# EAGLE design ocf4riser (EAGLE 7.7.0)
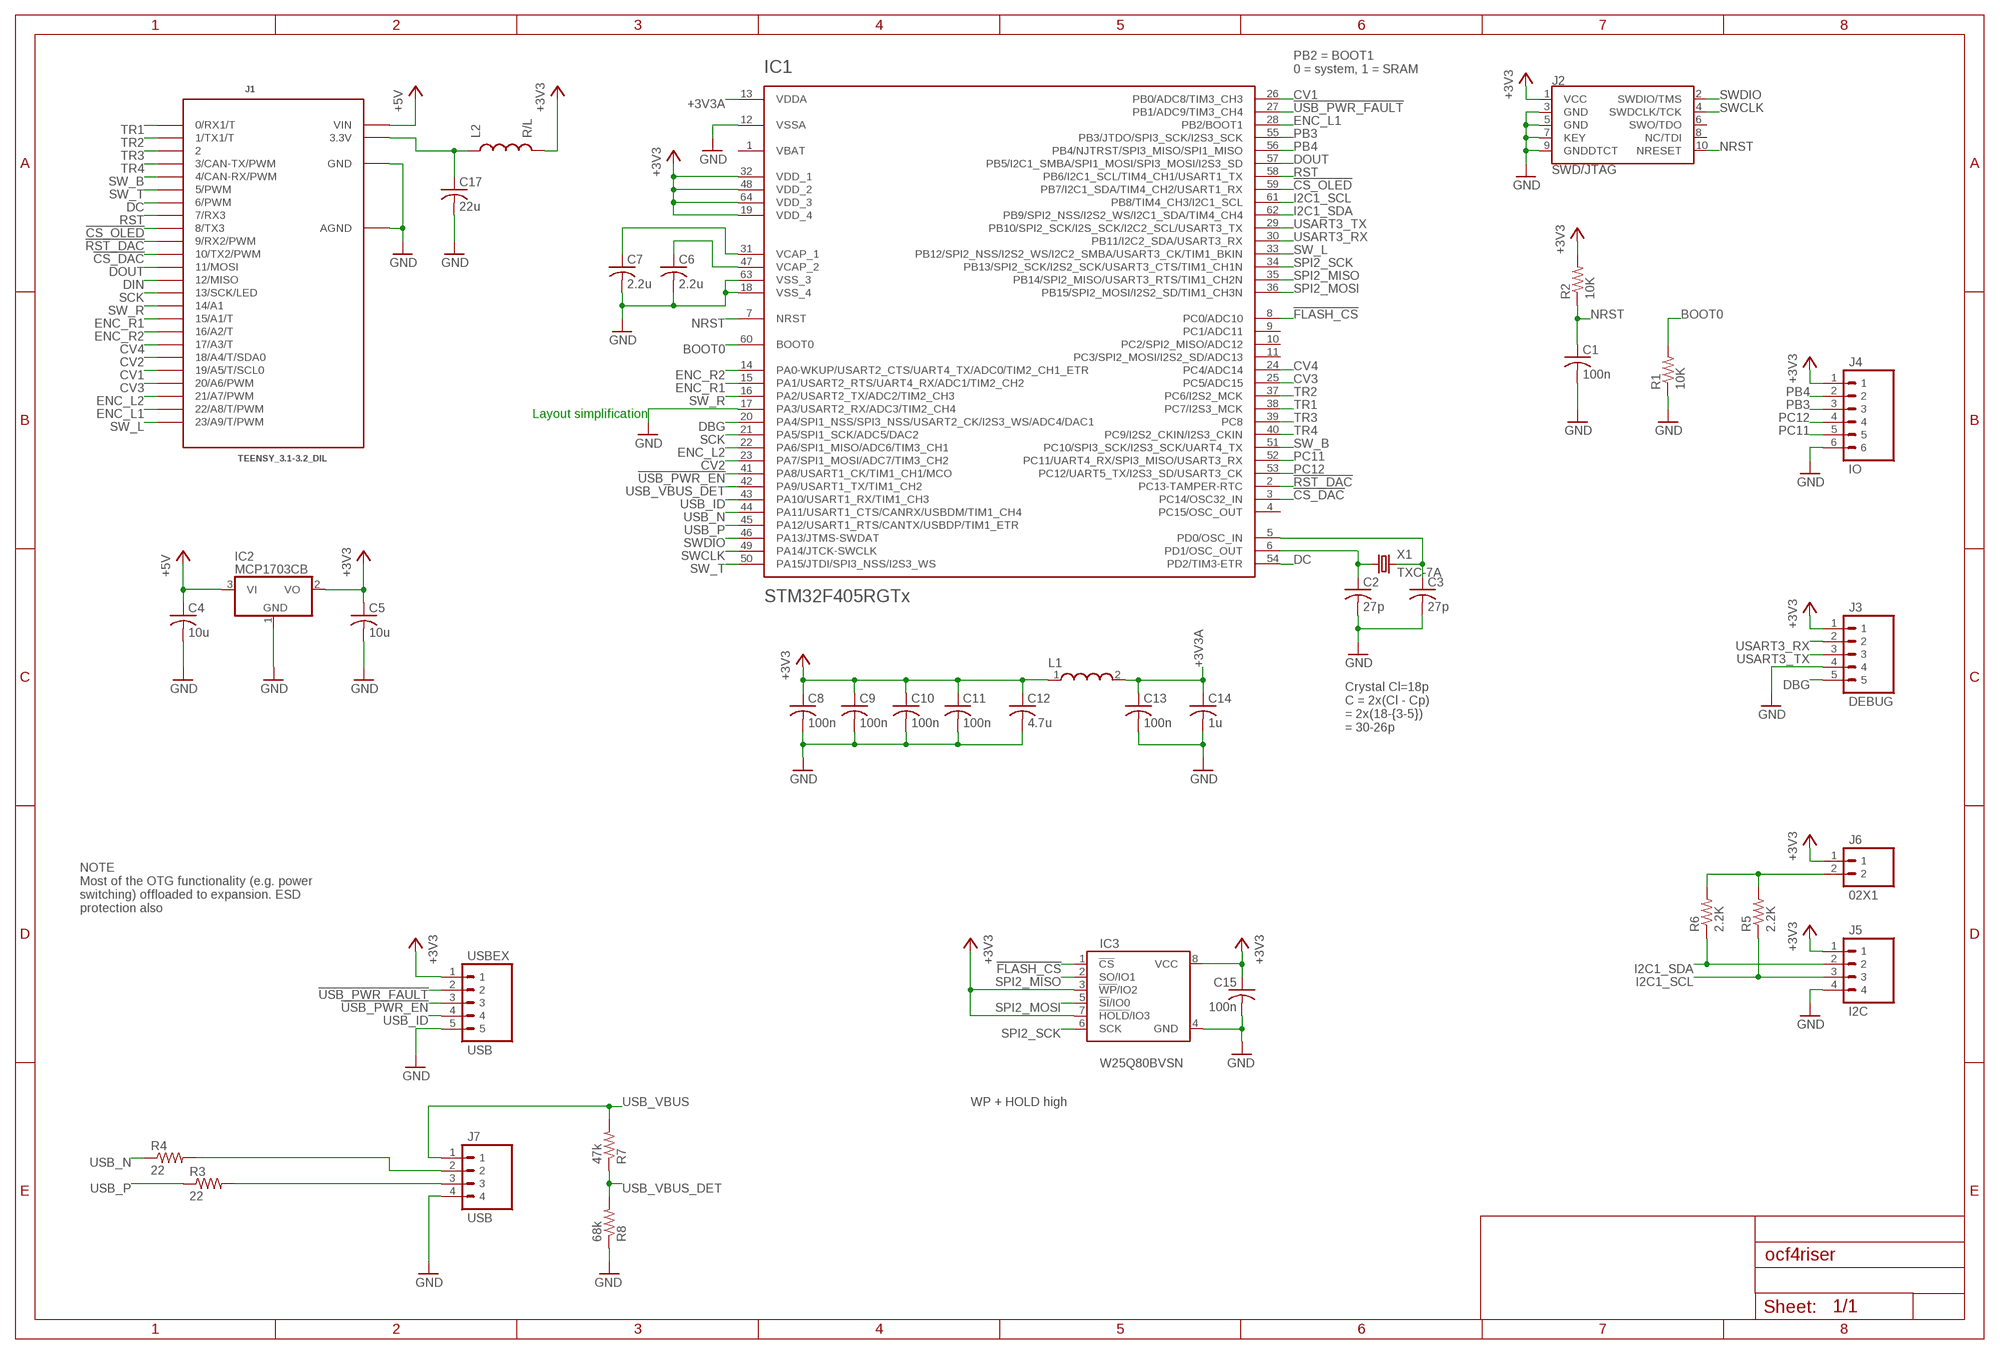
[diagram p0: schematic, sheet 1]

## Parts
C1  100n  C-USC0402  [C0402]
C2  27p  C-USC0402  [C0402]
C3  27p  C-USC0402  [C0402]
C4  10u  C-USC0805  [C0805]
C5  10u  C-USC0805  [C0805]
C6  2.2u  C-USC0603  [C0603]
C7  2.2u  C-USC0603  [C0603]
C8  100n  C-USC0402  [C0402]
C9  100n  C-USC0402  [C0402]
C10  100n  C-USC0402  [C0402]
C11  100n  C-USC0402  [C0402]
C12  4.7u  C-USC0603  [C0603]
C13  100n  C-USC0402  [C0402]
C14  1u  C-USC0603  [C0603]
C15  100n  C-USC0402  [C0402]
C17  22u  C-USC0805  [C0805]
IC1  STM32F405RGTx  STM32F20X  [TQFP-10X10-64]
IC2  MCP1703CB  [SOT23]
IC3  W25Q80BVSN  SPIFLASHN  [SOIC-8]
J1  TEENSY_3.1-3.2_DIL  [TEENSY_3.0-3.2&LC_DIL]
J2  SWD/JTAG  CORTEX_DEBUGNAKED  [2X5-1.27]
J3  DEBUG  05X1  [05X1-THIN]
J4  IO  06X1  [06X1-THIN]
J5  I2C  04X1  [04X1-THIN]
J6  02X1  [02X1-THIN]
J7  USB  04X1  [04X1-THIN]
L1  WE-CBF_0603(WB/HS)  [WE-CBF_0603(W=2.2)]
L2  R/L  INDUCTOR0805  [0805]
R1  10K  R-US_R0402  [R0402]
R2  10K  R-US_R0402  [R0402]
R3  22  R-US_R0402  [R0402]
R4  22  R-US_R0402  [R0402]
R5  2.2K  R-US_R0603  [R0603]
R6  2.2K  R-US_R0603  [R0603]
R7  47k  R-US_R0402  [R0402]
R8  68k  R-US_R0402  [R0402]
USBEX  USB  05X1  [05X1-THIN]
X1  TXC-7A  [CRYSTAL-TXC-7A]

## Nets
!CS_DAC: IC1.3(PC14/OSC32_IN) J1.10(10/TX2/PWM)
!CS_OLED: IC1.59(PB7/I2C1_SDA/TIM4_CH2/USART1_RX) J1.8(8/TX3)
!FLASH_CS: IC1.8(PC0/ADC10) IC3.1(!CS!)
!RST_DAC: IC1.2(PC13-TAMPER-RTC) J1.9(9/RX2/PWM)
!USB_PWR_EN: IC1.41(PA8/USART1_CK/TIM1_CH1/MCO) USBEX.3
!USB_PWR_FAULT: IC1.27(PB1/ADC9/TIM3_CH4) USBEX.2
+3V3: C5.1 C8.1 C9.1 C10.1 C11.1 C12.1 C15.1 IC1.19(VDD_4) IC1.32(VDD_1) IC1.48(VDD_2) IC1.64(VDD_3) IC2.2(VO) IC3.3(!WP!/IO2) IC3.7(!HOLD!/IO3) IC3.8(VCC) J2.1(VCC) J3.1 J4.1 J5.1 J6.1 L1.1 L2.2 R2.2 USBEX.1
+3V3A: C13.1 C14.1 IC1.13(VDDA) L1.2
+5V: C4.1 IC2.3(VI) J1.VIN
BOOT0: IC1.60(BOOT0) R1.2
CV1: IC1.26(PB0/ADC8/TIM3_CH3) J1.19/A5(19/A5/T/SCL0)
CV2: IC1.23(PA7/SPI1_MOSI/ADC7/TIM3_CH2) J1.18/A4(18/A4/T/SDA0)
CV3: IC1.25(PC5/ADC15) J1.20/A6(20/A6/PWM)
CV4: IC1.24(PC4/ADC14) J1.17/A3(17/A3/T)
DBG: IC1.20(PA4/SPI1_NSS/SPI3_NSS/USART2_CK/I2S3_WS/ADC4/DAC1) J3.5
DC: IC1.54(PD2/TIM3-ETR) J1.6(6/PWM)
DIN: J1.12(12/MISO)
DOUT: IC1.57(PB5/I2C1_SMBA/SPI1_MOSI/SPI3_MOSI/I2S3_SD) J1.11(11/MOSI)
ENC_L1: IC1.28(PB2/BOOT1) J1.22/A8(22/A8/T/PWM)
ENC_L2: IC1.22(PA6/SPI1_MISO/ADC6/TIM3_CH1) J1.21/A7(21/A7/PWM)
ENC_R1: IC1.15(PA1/USART2_RTS/UART4_RX/ADC1/TIM2_CH2) J1.15/A1(15/A1/T)
ENC_R2: IC1.14(PA0-WKUP/USART2_CTS/UART4_TX/ADC0/TIM2_CH1_ETR) J1.16/A2(16/A2/T)
GND: C1.2 C2.2 C3.2 C4.2 C5.2 C6.2 C7.2 C8.2 C9.2 C10.2 C11.2 C12.2 C13.2 C14.2 C15.2 C17.2 IC1.12(VSSA) IC1.17(PA3/USART2_RX/ADC3/TIM2_CH4) IC1.18(VSS_4) IC1.63(VSS_3) IC2.1(GND) IC3.4(GND) J1.AGND J1.GND J2.3(GND) J2.5(GND) J2.7(KEY) J2.9(GNDDTCT) J3.4 J4.6 J5.4 J7.4 R1.1 R8.1 USBEX.5
I2C1_SCL: IC1.61(PB8/TIM4_CH3/I2C1_SCL) J5.3 R5.1
I2C1_SDA: IC1.62(PB9/SPI2_NSS/I2S2_WS/I2C1_SDA/TIM4_CH4) J5.2 R6.1
I2C_PU: J6.2 R5.2 R6.2
N$1: C17.1 J1.3.3V L2.1
N$2: C3.1 IC1.5(PD0/OSC_IN) X1.P$2
N$3: C2.1 IC1.6(PD1/OSC_OUT) X1.P$1
NRST: C1.1 IC1.7(NRST) J2.10(NRESET) R2.1
PB3: IC1.55(PB3/JTDO/SPI3_SCK/I2S3_SCK) J4.3
PB4: IC1.56(PB4/NJTRST/SPI3_MISO/SPI1_MISO) J4.2
PC11: IC1.52(PC11/UART4_RX/SPI3_MISO/USART3_RX) J4.5
PC12: IC1.53(PC12/UART5_TX/I2S3_SD/USART3_CK) J4.4
RST: IC1.58(PB6/I2C1_SCL/TIM4_CH1/USART1_TX) J1.7(7/RX3)
SCK: IC1.21(PA5/SPI1_SCK/ADC5/DAC2) J1.13(13/SCK/LED)
SPI2_MISO: IC1.35(PB14/SPI2_MISO/USART3_RTS/TIM1_CH2N) IC3.2(SO/IO1)
SPI2_MOSI: IC1.36(PB15/SPI2_MOSI/I2S2_SD/TIM1_CH3N) IC3.5(!SI!/IO0)
SPI2_SCK: IC1.34(PB13/SPI2_SCK/I2S2_SCK/USART3_CTS/TIM1_CH1N) IC3.6(SCK)
SW_B: IC1.51(PC10/SPI3_SCK/I2S3_SCK/UART4_TX) J1.4(4/CAN-RX/PWM)
SW_L: IC1.33(PB12/SPI2_NSS/I2S2_WS/I2C2_SMBA/USART3_CK/TIM1_BKIN) J1.23/A9(23/A9/T/PWM)
SW_R: IC1.16(PA2/USART2_TX/ADC2/TIM2_CH3) J1.14/A0(14/A1)
SW_T: IC1.50(PA15/JTDI/SPI3_NSS/I2S3_WS) J1.5(5/PWM)
SWCLK: IC1.49(PA14/JTCK-SWCLK) J2.4(SWDCLK/TCK)
SWDIO: IC1.46(PA13/JTMS-SWDAT) J2.2(SWDIO/TMS)
TR1: IC1.38(PC7/I2S3_MCK) J1.0(0/RX1/T)
TR2: IC1.37(PC6/I2S2_MCK) J1.1(1/TX1/T)
TR3: IC1.39(PC8) J1.2
TR4: IC1.40(PC9/I2S2_CKIN/I2S3_CKIN) J1.3(3/CAN-TX/PWM)
USART3_RX: IC1.30(PB11/I2C2_SDA/USART3_RX) J3.2
USART3_TX: IC1.29(PB10/SPI2_SCK/I2S_SCK/I2C2_SCL/USART3_TX) J3.3
USB_I_N [USB]: J7.2 R4.2
USB_I_P [USB]: J7.3 R3.2
USB_ID: IC1.43(PA10/USART1_RX/TIM1_CH3) USBEX.4
USB_N [USB]: IC1.44(PA11/USART1_CTS/CANRX/USBDM/TIM1_CH4) R4.1
USB_P [USB]: IC1.45(PA12/USART1_RTS/CANTX/USBDP/TIM1_ETR) R3.1
USB_VBUS: J7.1 R7.2
USB_VBUS_DET: IC1.42(PA9/USART1_TX/TIM1_CH2) R7.1 R8.2
VCAP_1: C7.1 IC1.31(VCAP_1)
VCAP_2: C6.1 IC1.47(VCAP_2)
Unconnected: IC1.4(PC15/OSC_OUT) IC1.9(PC1/ADC11) IC1.10(PC2/SPI2_MISO/ADC12) IC1.11(PC3/SPI2_MOSI/I2S2_SD/ADC13) J2.6(SWO/TDO) J2.8(NC/TDI)

## Notes on the sheet
- PB2 = BOOT1
  0 = system, 1 = SRAM
- Layout simplification
- Crystal Cl=18p
  C = 2x(Cl - Cp)
  = 2x(18-{3-5})
  = 30-26p
- NOTE
  Most of the OTG functionality (e.g. power
  switching) offloaded to expansion. ESD
  protection also
- WP + HOLD high

## Power pins joined to a net without a drawn wire
VBAT: IC1.1(VBAT)

## Library data of the parts
C1-C15 C17 = pld-rcl:C-US: CAPACITOR, American symbol
IC1 = og-stm32f2:STM32F20X
IC2 = linear:MCP1703: 250 mA, 16V, Low Quiescent Current LDO Regulator Source: http://ww1.microchip.com/downloads/en/DeviceDoc/22049b.pdf
IC3 = pld-eeprom:SPIFLASH
J1 = pld-teensy:TEENSY_3.1-3.2_DIL: Teensy 3.1 or 3.2 in a DIL Layout.
J2 = pld-misc:CORTEX_DEBUG: Cortex Debug Connector Datasheet <http://infocenter.arm.com/help/topic/com.arm.doc.faqs/attached/13634/cortex_debug_connectors.pdf>
J3 USBEX = pld-headers:05X1: Thin pin header
J4 = pld-headers:06X1: Thin pin header
J5 J7 = pld-headers:04X1: Thin pin header
J6 = pld-headers:02X1
L1 = EagleLibrary_Wuerth_Elektronik_eiSos_rev16a:WE-CBF: WE-CBF SMD EMI Suppression Ferrite Bead Characteristics Reliable Ni-Sn electrodes High rated current up to 6 A Operating temperature: –55 ºC to +125 ºC Applications Perfect as data lined filter and for uncoupling of distribution voltage Variant abbreviation WB means WIDE BAND HS means HIGH SPEED HC means HIGH CURRENT <http://katalog.we-online.de/media/images/eisos/FeCBF_pf2.jpg> Details see: http://katalog.we-online.de/en/pbs/WE-CBF Updated on 2014-06-19 2014 (C) Wurth Elektronik
L2 = SparkFun-Passives:INDUCTOR: Inductors Basic Inductor/Choke - 0603 and 1206. Footprints are not proven and vary greatly between part numbers. INDUCTOR POWER 3.3UH 4.0A SMD 0.197" L x 0.197" W x 0.177" H (5.00mm x 5.00mm x 4.50mm)
R1-R8 = pld-rcl:R-US_: RESISTOR, American symbol
X1 = pld-txc:TXC-7A

## Net classes
1 USB: width 0.254 mm, drill 0.33 mm, clearance 0.159 mm to class 0

## Board
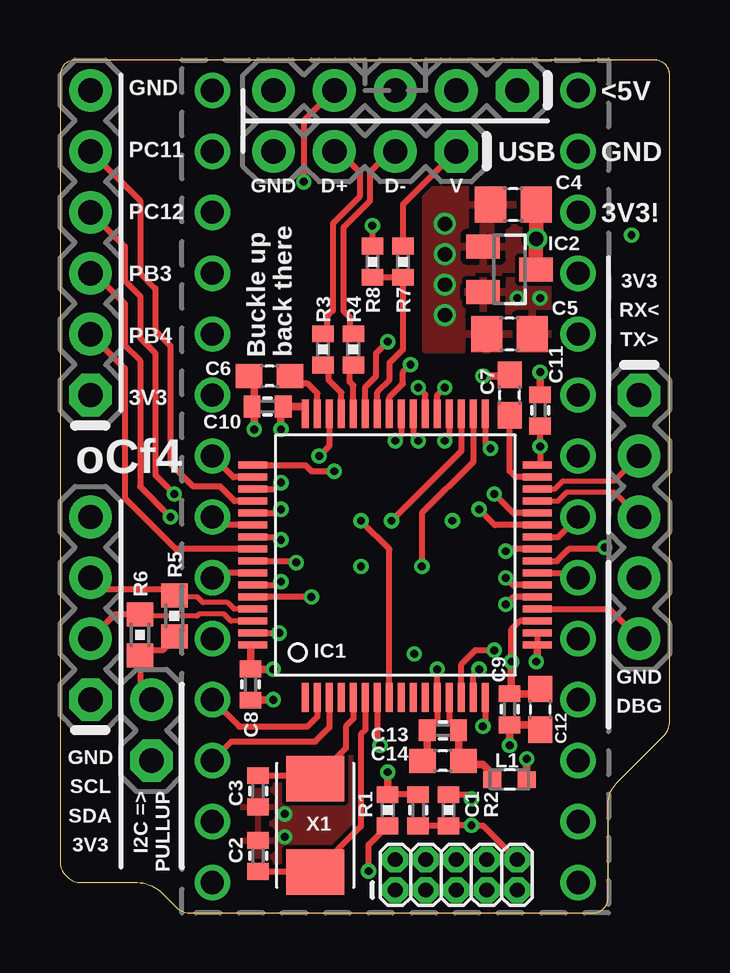
[diagram p1: board, top side]
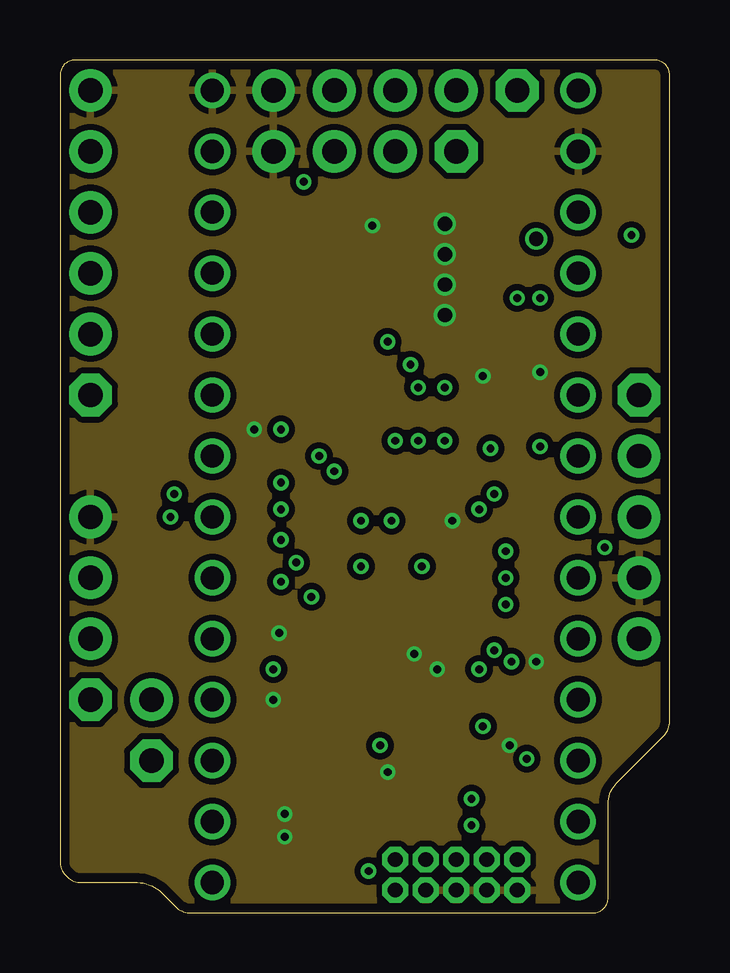
[diagram p2: board, inner layer Route2]
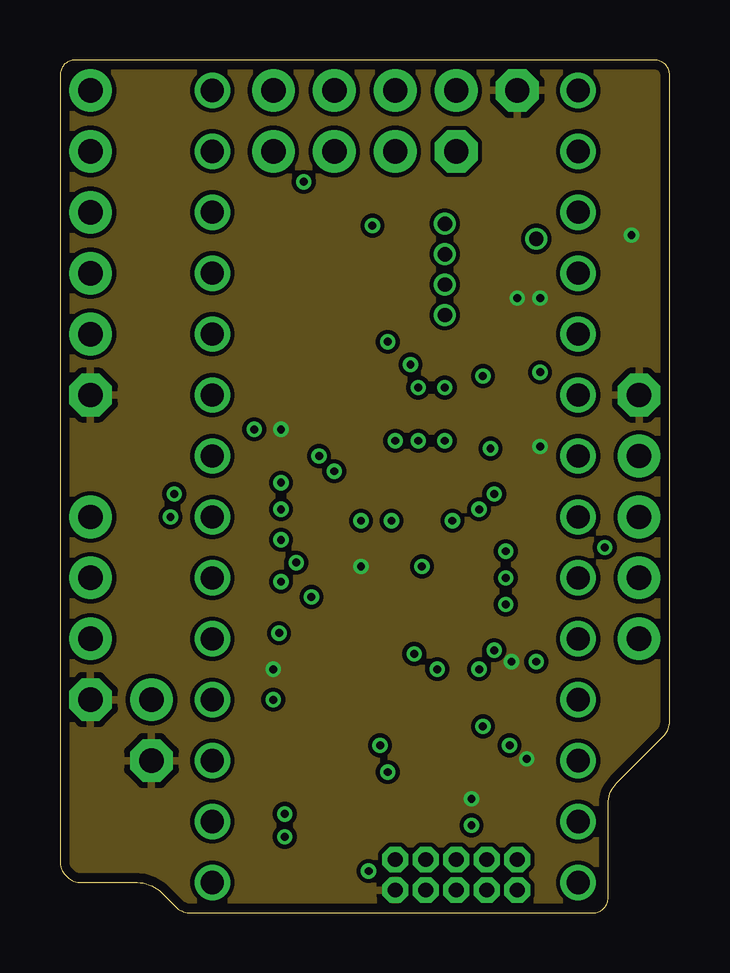
[diagram p3: board, inner layer Route15]
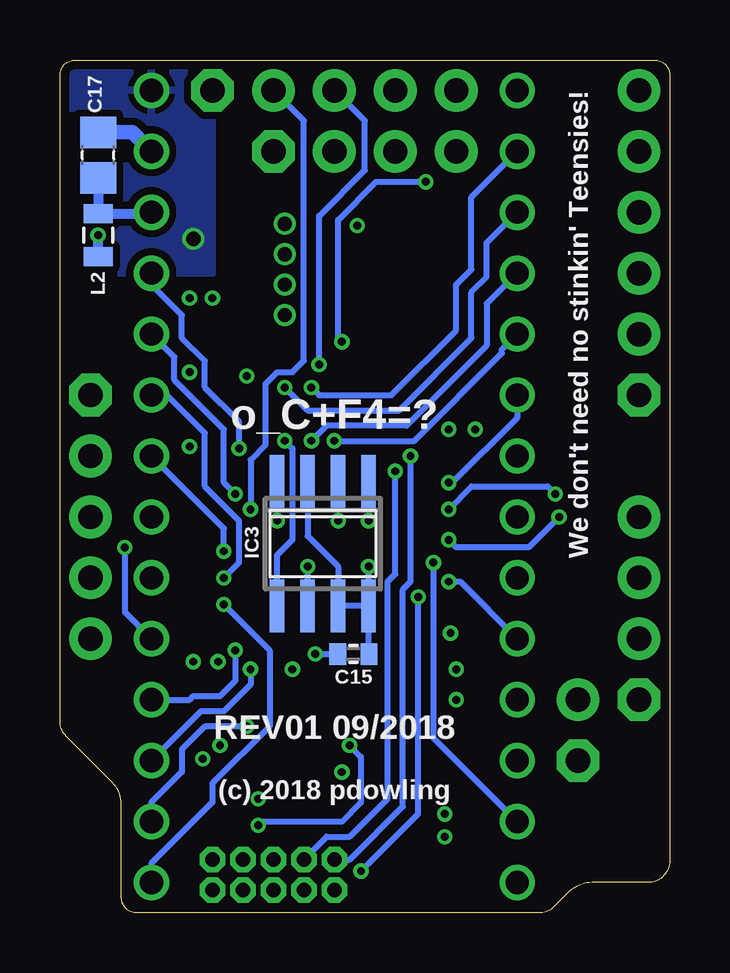
[diagram p4: board, bottom side, seen from below]

Size 25.4 x 35.56 mm. Coordinates in mm from the lower left corner, seen from the top.
Outline: 4.23,0.85 4.82,0.26 arc45 5.45,0 22.2,0 arc90 22.84,0.64 22.84,4.54 arc-45 23.21,5.43 25.14,7.36 arc45 25.4,7.99 25.4,34.92 arc90 24.77,35.56 0.63,35.56 arc90 0,34.92 0,2.17 arc90 0.9,1.27 3.22,1.27 arc-45 4.23,0.85
Copper layers (1*2*15*16): Top 0.035559375mm / dielectric 0.17018125mm / Route2 0.01778125mm / dielectric 47mil / Route15 0.01778125mm / dielectric 0.17018125mm / Bottom 0.035559375mm
Design rules "OSHPark-4layer *": minimum track width 5mil, minimum drill 10mil, track to track 7mil, track to pad 7mil, pad to pad 7mil, via to via 7mil, smd to smd 6mil, copper to edge 15mil, drill to drill 6mil, minimum pad ring 4mil, minimum via ring 6mil, stop-mask expansion 2.5mil, vias tented up to drill 13mil, thermal gap 10mil

### Footprints (pad centres in the part's own frame; a part is rotated, then mirrored left to right if it is on the bottom)
C0402 = smd 0.7 x 0.9: 1 -0.65,0; 2 0.65,0
C0805 = smd 1.3 x 1.5: 1 -0.95,0; 2 0.95,0
C0603 = smd 1.1 x 1: 1 -0.85,0; 2 0.85,0
TQFP-10X10-64 = smd 1.2 x 0.3: 1 -5.936,3.75; 2 -5.936,3.25; 3 -5.936,2.75; 4 -5.936,2.25; 5 -5.936,1.75; 6 -5.936,1.25; 7 -5.936,0.75; 8 -5.936,0.25; 9 -5.936,-0.25; 10 -5.936,-0.75; 11 -5.936,-1.25; 12 -5.936,-1.75; 13 -5.936,-2.25; 14 -5.936,-2.75; 15 -5.936,-3.25; 16 -5.936,-3.75; 33 5.886,-3.75; 34 5.886,-3.25; 35 5.886,-2.75; 36 5.886,-2.25; 37 5.886,-1.75; 38 5.886,-1.25; 39 5.886,-0.75; 40 5.886,-0.25; 41 5.886,0.25; 42 5.886,0.75; 43 5.886,1.25; 44 5.886,1.75; 45 5.886,2.25; 46 5.886,2.75; 47 5.886,3.25; 48 5.886,3.75 | smd 0.3 x 1.2: 17 -3.75,-5.911; 18 -3.25,-5.911; 19 -2.75,-5.911; 20 -2.25,-5.911; 21 -1.75,-5.911; 22 -1.25,-5.911; 23 -0.75,-5.911; 24 -0.25,-5.911; 25 0.25,-5.911; 26 0.75,-5.911; 27 1.25,-5.911; 28 1.75,-5.911; 29 2.25,-5.911; 30 2.75,-5.911; 31 3.25,-5.911; 32 3.75,-5.911; 49 3.75,5.936; 50 3.25,5.936; 51 2.75,5.936; 52 2.25,5.936; 53 1.75,5.936; 54 1.25,5.936; 55 0.75,5.936; 56 0.25,5.936; 57 -0.25,5.936; 58 -0.75,5.936; 59 -1.25,5.936; 60 -1.75,5.936; 61 -2.25,5.936; 62 -2.75,5.936; 63 -3.25,5.936; 64 -3.75,5.936
SOT23 = smd 1 x 1.4: 1 -0.95,-1.1; 2 0.95,-1.1; 3 0,1.1
SOIC-8 = smd 0.6 x 2.2: 1 -1.905,-2.6; 2 -0.635,-2.6; 3 0.635,-2.6; 4 1.905,-2.6; 5 1.905,2.6; 6 0.635,2.6; 7 -0.635,2.6; 8 -1.905,2.6
TEENSY_3.0-3.2&LC_DIL = drill 0.965 pad 1.473: 0 -7.62,13.97; 1 -7.62,11.43; 2 -7.62,8.89; 3 -7.62,6.35; 3.3V 7.62,11.43; 4 -7.62,3.81; 5 -7.62,1.27; 6 -7.62,-1.27; 7 -7.62,-3.81; 8 -7.62,-6.35; 9 -7.62,-8.89; 10 -7.62,-11.43; 11 -7.62,-13.97; 12 -7.62,-16.51; 13 7.62,-16.51; 14/A0 7.62,-13.97; 15/A1 7.62,-11.43; 16/A2 7.62,-8.89; 17/A3 7.62,-6.35; 18/A4 7.62,-3.81; 19/A5 7.62,-1.27; 20/A6 7.62,1.27; 21/A7 7.62,3.81; 22/A8 7.62,6.35; 23/A9 7.62,8.89; AGND 7.62,13.97; GND -7.62,16.51; VIN 7.62,16.51
2X5-1.27 = drill 0.61 pad 1.067 octagon: 1 0,0; 2 0,1.27; 3 1.27,0; 4 1.27,1.27; 5 2.54,0; 6 2.54,1.27; 7 3.81,0; 8 3.81,1.27; 9 5.08,0; 10 5.08,1.27
05X1-THIN = drill 1.016 pad 1.778 octagon: 1 0,0 | drill 1.016 pad 1.778: 2 2.54,0; 3 5.08,0; 4 7.62,0; 5 10.16,0
06X1-THIN = drill 1.016 pad 1.778 octagon: 1 0,0 | drill 1.016 pad 1.778: 2 2.54,0; 3 5.08,0; 4 7.62,0; 5 10.16,0; 6 12.7,0
04X1-THIN = drill 1.016 pad 1.778 octagon: 1 0,0 | drill 1.016 pad 1.778: 2 2.54,0; 3 5.08,0; 4 7.62,0
02X1-THIN = drill 1.016 pad 1.778 octagon: 1 0,0 | drill 1.016 pad 1.778: 2 2.54,0
WE-CBF_0603(W=2.2) = smd 0.75 x 0.7: 1 -0.725,0; 2 0.725,0
0805 = smd 0.8 x 1.2: 1 -0.9,0; 2 0.9,0
R0402 = smd 0.7 x 0.9: 1 -0.65,0; 2 0.65,0
R0603 = smd 1 x 1.1: 1 -0.85,0; 2 0.85,0
CRYSTAL-TXC-7A = smd 1.9 x 2.4: P$1 1.95,0; P$2 -1.95,0

### Placement (x,y rotation side)
C1  14.92,4.29 90 top
C2  8.25,2.38 90 top
C3  8.25,5.08 270 top
C4  18.89,29.53 180 top
C5  18.73,24.13 180 top
C6  8.73,22.38 180 top
C7  18.73,21.59 90 top
C8  7.94,9.53 270 top
C9  18.73,8.49 270 top
C10  8.65,21.11 180 top
C11  20,20.95 90 top
C12  20,8.49 270 top
C13  15.95,7.62 180 top
C14  15.95,6.35 180 top
C15  13.18,10.79 180 bottom
C17  23.81,31.59 90 bottom
IC1  13.97,14.92 90 top
IC2  18.73,26.83 270 top
IC3  14.45,15.4 180 bottom
J1  13.97,17.78 0 top
J2  13.97,0.95 0 top
J3  24.13,21.59 270 top
J4  1.27,21.59 90 top
J5  1.27,8.89 90 top
J6  3.81,6.35 90 top
J7  16.51,31.75 180 top
L1  18.73,5.56 180 top
L2  23.81,28.26 270 bottom
R1  13.65,4.29 270 top
R2  16.19,4.29 90 top
R3  10.95,23.5 90 top
R4  12.22,23.5 90 top
R5  4.76,12.38 270 top
R6  3.33,11.59 270 top
R7  14.29,27.15 90 top
R8  13.02,27.15 270 top
USBEX  19.05,34.29 180 top
X1  10.64,3.65 270 top

### Tracks (layer width: path | path; a pad name or v marks a point on that pad's centre or on a via)
!CS_DAC
  Top 0.254: J1.10 7.14,7.14 10.64,7.14 11.22,7.73 IC1.3
!CS_OLED  (via drill 0.33)
  Top 0.254: IC1.59 9.07,13.67 v9.21,13.81
  Bottom 0.254: v9.21,13.81 8.73,13.81 J1.8
!FLASH_CS  (via drill 0.33)
  Top 0.254: IC1.8 13.72,15.17 v12.54,16.35
  Bottom 0.254: IC3.1 v12.54,16.35
!RST_DAC
  Top 0.254: J1.9 7.46,7.78 10.32,7.78 10.72,8.18 IC1.2
!USB_PWR_EN  (via drill 0.33)
  Top 0.254: IC1.41 13.72,21.5 14.29,22.07 14.29,22.54 v14.61,22.86
  Bottom 0.254: v14.61,22.86 14.61,29.05 12.7,30.96 12.7,33.02 USBEX.3
!USB_PWR_FAULT  (via drill 0.33)
  Top 0.254: IC1.27 18.12,16.17 v17.46,16.83
  Bottom 0.254: v17.46,16.83 17.46,18.89 16.83,19.53 16.83,22.07 16.35,22.54 15.72,22.54 15.24,23.02 15.24,33.02 USBEX.2
+3V3  (via drill 0.33)
  Top 0.254: v18.81,10.48 18.81,11.83 19.16,12.17 IC1.19 | IC1.32 20,18.79 v20,19.45 C11.1 | R2.2 16.97,4.94 v17.14,4.76
  Top 0.305: IC1.64 7.94,11.08 C8.1 7.95,10.16 v8.89,10.16 | 20,9.3 C12.1 | v9.21,20.16 9.21,21.02 C10.1 10.16,21.11 10.22,21.05 IC1.48 | C12.1 19.98,9.34 | v18.81,10.48 18.81,9.22 C9.1 19.8,9.14 C12.1 | v19.45,6.43 19.45,5.57 L1.1
  Route15 0.254: v12.54,14.45 12.7,14.45
  Bottom 0.254: C15.1 12.53,12.78 IC3.8 | IC3.8 v12.54,14.45 | IC3.8 IC3.7 13.81,14.45 15.08,15.72 IC3.3
  Bottom 0.406: L2.2 v23.81,28.26
  other vias: 20,25.64 19.05,25.64
  pour Route15 (rank 6): -2.54,36.83 -2.54,-1.27 26.67,-1.27 26.67,36.83
  pour Top: 16.99,25.08 18.57,25.08 20.32,23.5 20.32,26.35 16.99,26.35
+3V3A
  Top 0.254: IC1.13 16.22,8 C13.1
  Top 0.305: C13.1 16.6,6.55 C14.1 16.96,6.19 17.62,6.19 18.01,5.8 L1.2
+5V  (via drill 0.6)
  Top 0.508: C4.1 | 19.83,28.09 v19.84,28.1
  Top 0.61: v19.84,28.1 C4.1 | IC2.3 19.83,28.09
  pour Bottom (isolate 0.305): 19.05,36.83 19.05,26.67 26.67,26.67 26.67,36.83
BOOT0  (via drill 0.33)
  Top 0.254: v10.48,13.18 IC1.60 | v12.86,1.75 12.86,2.84 R1.2
  Bottom 0.254: v10.48,13.18 10.48,4.13 v12.86,1.75
CV1
  Top 0.254: IC1.26 20.75,15.67 J1.19/A5
CV2
  Top 0.254: IC1.23 21.39,14.17 J1.18/A4
CV3  (via drill 0.33)
  Top 0.254: IC1.25 18.66,15.17 v18.57,15.08
  Bottom 0.254: v18.57,15.08 18.57,16.03 J1.20/A6
CV4  (via drill 0.33)
  Top 0.254: v22.7,15.24 22.63,15.17 21.2,15.17 20.7,14.67 IC1.24
  Bottom 0.254: v22.7,15.24 22.7,12.54 J1.17/A3
DBG
  Top 0.254: IC1.20 22.89,12.67 J3.5
DC
  Top 0.254: IC1.54 6.69,16.17 J1.6
DOUT  (via drill 0.33)
  Top 0.254: IC1.57 9.78,14.67 v9.84,14.61
  Bottom 0.254: v9.84,14.61 9.84,7.3 J1.11
ENC_L1  (via drill 0.33)
  Top 0.254: IC1.28 18.89,16.67 v18.1,17.46
  Bottom 0.254: v18.1,17.46 18.57,17.94 18.57,20.16 20.64,22.23 20.64,23.18 J1.22/A8
ENC_L2  (via drill 0.33)
  Top 0.254: IC1.22 18.87,13.67 v18.57,13.97
  Bottom 0.254: J1.21/A7 20.95,21.59 19.37,20 19.37,17.78 17.94,16.35 17.94,14.61 v18.57,13.97
ENC_R1  (via drill 0.33)
  Top 0.254: IC1.15 17.22,9.92 v17.46,10.16
  Bottom 0.254: v17.46,10.16 17.46,9.53 18.57,8.41 19.53,8.41 J1.15/A1
ENC_R2  (via drill 0.33)
  Top 0.254: IC1.14 16.72,10.37 17.3,10.95 v18.1,10.95
  Bottom 0.254: v18.1,10.95 18.1,9.68 18.73,9.05 19.84,9.05 20,8.89 J1.16/A2
GND  (via drill 0.33, 0.6)
  Top 0.254: IC1.63 v9.12,11.67 v9.13,11.67 | IC1.18 IC1.17 | C13.2 15.72,8.04 IC1.12 v15.72,10.16 | C1.2 R1.1 | 18.68,22.38 C7.2 | v13.02,28.65 R8.1
  Top 0.305: v18.73,6.99 C9.2 19.8,7.84 C12.2 | C13.2 15.3,6.55 C14.2 | v13.65,5.87 R1.1 | v8.89,8.89 7.95,8.89 C8.2 | C11.2 v20,22.54 | v17.62,22.38 18.68,22.38 | v8.1,20.16 8.1,21.02 C10.2 8,21.18 8.1,21.27 8.1,22.17 C6.2 | IC1.17 19.88,10.52 v19.84,10.48
  Bottom 0.254: v14.76,10.79 C15.2 | IC3.4 v16.35,16.35
  Bottom 0.61: C17.2 22.38,32.54 J1.AGND
  other vias: 9.37,4.13 9.37,3.17 16.03,28.73 16.03,27.46 16.03,26.19 16.03,24.92
  pour Route2 (isolate 0.254): -2.54,36.83 -2.54,-1.27 26.67,-1.27 26.67,36.83
  pour Top: 7.62,6.99 7.62,0.64 12.7,0.64 12.7,6.99
  pour Top (rank 6): 19.21,30.16 15.24,30.16 15.24,23.5 19.05,23.5
I2C1_SCL
  Top 0.203: IC1.61 7.25,12.67 6.99,12.94 5.95,12.94 5.71,13.18 4.82,13.18 R5.1
  Top 0.254: R5.1 4.76,13.34 4.6,13.49 1.75,13.49 J5.3
I2C1_SDA
  Top 0.203: IC1.62 7.12,12.17 6.83,12.46 5.79,12.46 5.71,12.38 3.39,12.38 R6.1
  Top 0.254: R6.1 2.28,12.44 J5.2
I2C_PU
  Top 0.254: J6.2 3.33,9.37 R6.2 3.55,10.95 4.29,10.95 4.76,11.43 R5.2
N$1
  Bottom 0.406: J1.3.3V 21.64,29.16 L2.1 C17.1
N$2
  Top 0.254: C3.1 10.64,5.73 X1.P$2 11.91,6.87 11.91,7.78 12.22,8.09 IC1.5
N$3
  Top 0.254: C2.1 10.61,1.73 X1.P$1 12.54,3.61 12.54,7.46 12.72,7.64 IC1.6
NRST  (via drill 0.33)
  Top 0.254: C1.1 R2.1 16.21,3.65 v17.14,3.65 17.62,3.65 J2.10 | IC1.7 13.22,7.1 v13.34,6.99
  Bottom 0.254: v13.34,6.99 12.86,6.51 12.86,4.6 13.65,3.81 16.99,3.81 v17.14,3.65
PB3  (via drill 0.33)
  Top 0.254: IC1.55 9.09,15.67 v9.21,15.56 | v4.6,16.51 3.33,17.78 3.33,23.02 2.7,23.65 2.7,25.4 1.43,26.67 J4.3
  Bottom 0.254: v4.6,16.51 5.87,15.24 8.89,15.24 v9.21,15.56
PB4
  Top 0.254: IC1.56 4.83,15.17 2.7,17.3 2.7,22.7 J4.2
PC11
  Top 0.254: IC1.52 7.28,17.17 6.67,17.78 5.56,17.78 4.6,18.73 4.6,23.65 3.97,24.29 3.97,26.04 3.33,26.67 3.33,29.69 J4.5
PC12  (via drill 0.33)
  Top 0.254: v4.76,17.46 3.97,18.26 3.97,23.34 3.33,23.97 3.33,25.72 2.7,26.35 2.7,27.78 J4.4 | IC1.53 9.05,16.67 v9.21,16.83
  Bottom 0.254: v9.21,16.83 8.25,17.78 5.08,17.78 v4.76,17.46
RST
  Top 0.254: IC1.58 6.55,14.17 J1.7
SCK  (via drill 0.33)
  Top 0.254: IC1.21 18.89,13.17 v18.57,12.86
  Bottom 0.254: J1.13 21.59,2.06 19.05,4.6 19.05,5.4 16.67,7.78 16.67,10.95 v18.57,12.86
SPI2_MISO  (via drill 0.33)
  Top 0.254: IC1.35 16.72,19.26 v13.81,16.35
  Bottom 0.254: IC3.2 v13.81,16.35
SPI2_MOSI  (via drill 0.33)
  Top 0.254: IC1.36 16.22,19.87 v16.03,19.68
  Bottom 0.254: v16.03,19.68 15.72,19.37 15.72,15.56 16.35,14.92 IC3.5
SPI2_SCK  (via drill 0.33)
  Top 0.254: IC1.34 17.22,18.81 15.08,16.67 v15.08,14.45
  Bottom 0.254: IC3.6 v15.08,14.45
SW_B  (via drill 0.33)
  Top 0.254: IC1.51 8.94,17.67 v9.21,17.94
  Bottom 0.254: J1.4 6.35,20.64 9.05,17.94 v9.21,17.94
SW_L  (via drill 0.33)
  Top 0.254: IC1.33 17.72,19.59 v17.94,19.37
  Bottom 0.254: v17.94,19.37 17.94,20.48 19.37,21.91 19.37,23.02 20.32,23.97 20.32,24.92 21.59,26.19 J1.23/A9
SW_R  (via drill 0.33)
  Top 0.254: IC1.16 17.72,7.88 v17.62,7.78
  Bottom 0.254: v17.62,7.78 19.37,7.78 20.32,6.83 20.32,5.87 21.59,4.6 J1.14/A0
SW_T
  Top 0.254: IC1.50 7.23,18.17 J1.5
SWCLK  (via drill 0.33)
  Top 0.254: IC1.49 10.22,18.67 10.48,18.41 v11.43,18.41
  Bottom 0.254: v11.43,18.41 11.43,14.13 11.75,13.81 11.75,4.76 13.34,3.17 14.29,3.17 J2.4
SWDIO  (via drill 0.33)
  Top 0.254: IC1.46 11.22,19.48 v10.79,19.05
  Bottom 0.254: J2.2 13.34,2.22 11.11,4.45 11.11,13.49 10.79,13.81 v10.79,19.05
TR1  (via drill 0.33)
  Top 0.254: IC1.38 15.22,21.61 v14.92,21.91
  Bottom 0.254: J1.0 8.25,29.84 8.25,26.83 8.89,26.19 8.89,24.29 11.59,21.59 14.61,21.59 v14.92,21.91
TR2  (via drill 0.33)
  Top 0.254: IC1.37 15.72,21.59 v16.03,21.91
  Bottom 0.254: J1.1 7.62,27.94 7.62,26.51 8.25,25.88 8.25,23.97 11.27,20.95 15.08,20.95 v16.03,21.91
TR3  (via drill 0.33)
  Top 0.254: IC1.39 14.72,19.89 v14.92,19.68
  Bottom 0.254: J1.2 7.62,25.4 7.62,23.65 10.95,20.32 14.29,20.32 v14.92,19.68
TR4  (via drill 0.33)
  Top 0.254: IC1.40 14.22,19.93 v13.97,19.68
  Bottom 0.254: v13.97,19.68 10.64,19.68 6.99,23.34 6.99,23.5 J1.3
USART3_RX
  Top 0.203: IC1.30 20.61,17.67 20.95,18.02 23.1,18.02 J3.2
USART3_TX
  Top 0.203: IC1.29 20.74,17.17 21.11,17.54 23.1,17.54 J3.3
USB_I_N
  Top 0.254: 11.8,26.83 11.8,28.57 12.92,29.68 12.92,30.88 13.79,31.75 J7.2 | 11.8,26.83 11.8,25.11 12.07,24.84 12.07,24.3 R4.2 | 11.81,26.83 11.8,26.83
USB_I_P
  Top 0.254: R3.2 11.11,24.3 11.11,24.84 11.37,25.11 11.37,28.74 12.48,29.86 12.48,30.88 11.61,31.75 J7.3
USB_ID  (via drill 0.33)
  Top 0.254: IC1.43 12.72,21.93 13.18,22.38 13.18,23.34 v13.65,23.81 | USBEX.4 10.16,33.02 v10.16,30.48
  Bottom 0.254: v13.65,23.81 13.81,23.97 13.81,28.89 12.22,30.48 v10.16,30.48
USB_N
  Top 0.254: IC1.44 12.22,21.99 12.07,22.15 12.07,22.69 R4.1
USB_P
  Top 0.254: IC1.45 11.72,21.7 11.19,22.23 11.19,22.61 R3.1
USB_VBUS
  Top 0.254: J7.1 14.29,29.53 R7.2
USB_VBUS_DET
  Top 0.254: IC1.42 13.22,21.71 13.73,22.23 13.73,22.94 14.29,23.5 R7.1 R8.2
VCAP_1
  Top 0.254: IC1.31 18.98,18.17 18.73,18.41 C7.1
VCAP_2
  Top 0.254: IC1.47 10.72,21.66 10.32,22.07 9.9,22.07 C6.1

### Text on the board
tPlace: <5V | USB | GND | GND | D+ | D- | V | 3V3! | GND / / PC11 / / PC12 / / PB3 / / PB4 / / 3V3 | 3V3 / RX< / TX> | Buckle up / back there | oCf4 | GND / DBG | I2C => / PULLUP | GND / SCL / SDA / 3V3
bPlace: We don't need no stinkin' Teensies! | o_C+F4=? | REV01 09/2018 | (c) 2018 pdowling